# Altium schematic sheet 传感器.SchDoc
size A4
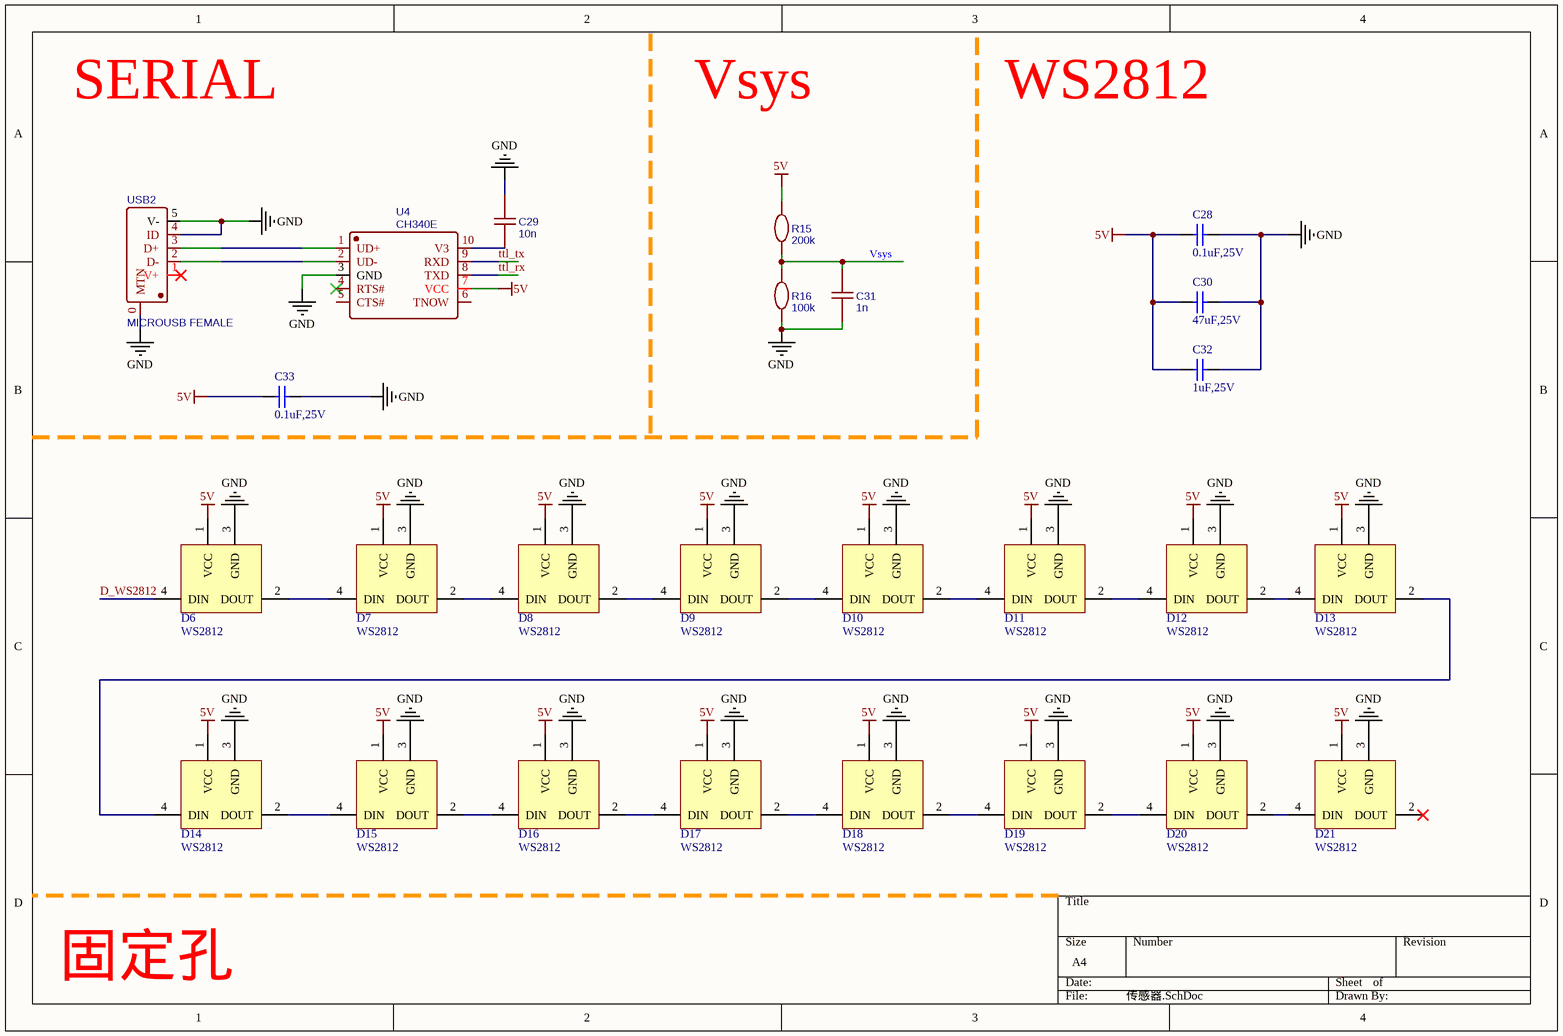
[diagram p0: 传感器.SchDoc]

## Parts
C28  value 0.1uF,25V  [0402_C]  (hidden comment: Cap)
C29  10n  [0402_C]
C30  value 47uF,25V  [0402_C]  (hidden comment: Cap)
C31  1n  [0402_C]
C32  value 1uF,25V  [0402_C]  (hidden comment: Cap)
C33  value 0.1uF,25V  [0402_C]  (hidden comment: Cap)
D6  WS2812  [LED-SMD_4P-L3.5-W3.5-TL_WS2812B]
D7  WS2812  [LED-SMD_4P-L3.5-W3.5-TL_WS2812B]
D8  WS2812  [LED-SMD_4P-L3.5-W3.5-TL_WS2812B]
D9  WS2812  [LED-SMD_4P-L3.5-W3.5-TL_WS2812B]
D10  WS2812  [LED-SMD_4P-L3.5-W3.5-TL_WS2812B]
D11  WS2812  [LED-SMD_4P-L3.5-W3.5-TL_WS2812B]
D12  WS2812  [LED-SMD_4P-L3.5-W3.5-TL_WS2812B]
D13  WS2812  [LED-SMD_4P-L3.5-W3.5-TL_WS2812B]
D14  WS2812  [LED-SMD_4P-L3.5-W3.5-TL_WS2812B]
D15  WS2812  [LED-SMD_4P-L3.5-W3.5-TL_WS2812B]
D16  WS2812  [LED-SMD_4P-L3.5-W3.5-TL_WS2812B]
D17  WS2812  [LED-SMD_4P-L3.5-W3.5-TL_WS2812B]
D18  WS2812  [LED-SMD_4P-L3.5-W3.5-TL_WS2812B]
D19  WS2812  [LED-SMD_4P-L3.5-W3.5-TL_WS2812B]
D20  WS2812  [LED-SMD_4P-L3.5-W3.5-TL_WS2812B]
D21  WS2812  [LED-SMD_4P-L3.5-W3.5-TL_WS2812B]
R15  200k  [0402_R]
R16  100k  [0402_R]
U4  CH340E  [MSOP-10_L3.0-W3.0-P0.50-LS5.0-BL]
USB2  MICROUSB FEMALE  [USB-B/S_A]

## Nets
5V: C28.2 C30.2 C32.2 C33.2 D6.1(VCC) D7.1(VCC) D8.1(VCC) D9.1(VCC) D10.1(VCC) D11.1(VCC) D12.1(VCC) D13.1(VCC) D14.1(VCC) D15.1(VCC) D16.1(VCC) D17.1(VCC) D18.1(VCC) D19.1(VCC) D20.1(VCC) D21.1(VCC) R15.2 U4.7(VCC)
GND: C28.1 C29.2 C30.1 C31.1 C32.1 C33.1 D6.3(GND) D7.3(GND) D8.3(GND) D9.3(GND) D10.3(GND) D11.3(GND) D12.3(GND) D13.3(GND) D14.3(GND) D15.3(GND) D16.3(GND) D17.3(GND) D18.3(GND) D19.3(GND) D20.3(GND) D21.3(GND) R16.1 U4.3(GND) USB2.0(MTN) USB2.4(ID) USB2.5(V-)
D_WS2812: D6.4(DIN)
ttl_rx: U4.8(TXD)
ttl_tx: U4.9(RXD)
Vsys: C31.2 R15.1 R16.2
NetC29_1: C29.1 U4.10(V3)
NetD6_2: D6.2(DOUT) D7.4(DIN)
NetD7_2: D7.2(DOUT) D8.4(DIN)
NetD8_2: D8.2(DOUT) D9.4(DIN)
NetD9_2: D9.2(DOUT) D10.4(DIN)
NetD10_2: D10.2(DOUT) D11.4(DIN)
NetD11_2: D11.2(DOUT) D12.4(DIN)
NetD12_2: D12.2(DOUT) D13.4(DIN)
NetD13_2: D13.2(DOUT) D14.4(DIN)
NetD14_2: D14.2(DOUT) D15.4(DIN)
NetD15_2: D15.2(DOUT) D16.4(DIN)
NetD16_2: D16.2(DOUT) D17.4(DIN)
NetD17_2: D17.2(DOUT) D18.4(DIN)
NetD18_2: D18.2(DOUT) D19.4(DIN)
NetD19_2: D19.2(DOUT) D20.4(DIN)
NetD20_2: D20.2(DOUT) D21.4(DIN)
NetU4_1: U4.1(UD+) USB2.3(D+)
NetU4_2: U4.2(UD-) USB2.2(D-)

Not connected (* = marked no-connect by the designer): D21 2(DOUT)*; U4 4(RTS#)* 5(CTS#) 6(TNOW); USB2 1(V+)*

## Notes on the sheet
- SERIAL
- Vsys
- WS2812
- 固定孔

## Library data of the parts
C28 C30 C32 C33 = T_Cap_0603_0.1uF_25V_X5R: 贴片电容; Part Typer: X5R; Solder: SMD; Withstand Voltage: 25V; Tolerance: 10%; Schematic Path: X:\Database\Schematic Library.Schlib; Part Number: T_Cap_0603_0.1uF_25V_X5R; LibRef: T_Cap_0603_0.1uF_25V_X5R
C29 = 10n: nameAlias: Value(F); Contributor: LCEDA_Lib; spicePre: C; spiceSymbolName: C_0603_US
C31 = 1n: nameAlias: Value(F); Contributor: LCEDA_Lib; spicePre: C; spiceSymbolName: C_0603_US
R15 = 200k: nameAlias: Value(Ω); Contributor: LCEDA_Lib; spicePre: R; spiceSymbolName: R_0603_EU
R16 = 100k: nameAlias: Value(Ω); Contributor: LCEDA_Lib; spicePre: R; spiceSymbolName: R_0603_EU
U4 = CH340E: BOM_Manufacturer: WCH; BOM_Supplier: LCSC; BOM_Manufacturer Part: CH340E; BOM_Supplier Part: C99652; BOM_JLCPCB Part Class: Extended Part; spicePre: U; spiceSymbolName: CH340E
USB2 = MICROUSB FEMALE: BOM_Manufacturer: ValuePro; BOM_Supplier: LCSC; BOM_Manufacturer Part: micro USBFemale; BOM_Supplier Part: C10418; BOM_JLCPCB Part Class: Extended Part; spicePre: U; spiceSymbolName: MICROUSB FEMALE